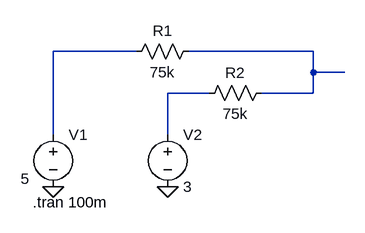
[diagram p0: schematic Draft1.asc]
Draft1.asc, the LTspice schematic file:
Version 4
SHEET 1 880 680
WIRE 144 48 16 48
WIRE 416 48 224 48
WIRE 416 80 416 48
WIRE 464 80 416 80
WIRE 256 112 192 112
WIRE 416 112 416 80
WIRE 416 112 336 112
WIRE 16 176 16 48
WIRE 192 176 192 112
FLAG 16 256 0
FLAG 192 256 0
SYMBOL voltage 16 160 R0
WINDOW 123 0 0 Left 2
WINDOW 39 0 0 Left 2
WINDOW 3 -50 84 Left 2
SYMATTR Value 5
SYMATTR InstName V1
SYMBOL voltage 192 160 R0
WINDOW 123 0 0 Left 2
WINDOW 39 0 0 Left 2
SYMATTR InstName V2
SYMATTR Value 3
SYMBOL res 240 32 R90
WINDOW 0 0 56 VBottom 2
WINDOW 3 32 56 VTop 2
SYMATTR InstName R1
SYMATTR Value 75k
SYMBOL res 352 96 R90
WINDOW 0 0 56 VBottom 2
WINDOW 3 32 56 VTop 2
SYMATTR InstName R2
SYMATTR Value 75k
TEXT -16 280 Left 2 !.tran 100m

The netlist it stands for:
* Draft1.asc
V1 N001 0 5
V2 N003 0 3
R1 N002 N001 75k
R2 N002 N003 75k
.tran 100m
.backanno
.end